# EAGLE design BeamBreak (EAGLE 6.5.0)
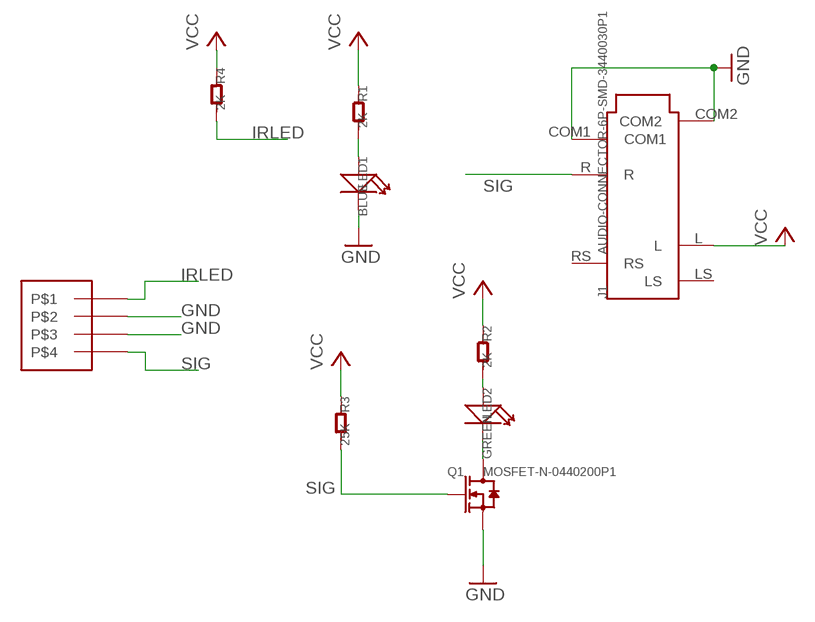
[diagram p0: schematic, sheet 1]

## Parts
J1  AUDIO-CONNECTOR-6P-SMD-3440030P1  [6P-SMD-3.5]
LED1  BLUE  LED  [LED0603]
LED2  GREEN  LED  [LED0603]
Q1  MOSFET-N-0440200P1  [SOT23]
R1  2K  R-0603  [R0603]
R2  2K  R-0603  [R0603]
R3  25K  R-0603  [R0603]
R4  2K  R-0603  [R0603]
U$1  HO4  [H04]

## Nets
GND: J1.COM1 J1.COM2 LED1.- Q1.2(S) U$1.2 U$1.3
IRLED: R4.2 U$1.1
N$1: LED2.+ R2.2
N$3: LED2.- Q1.3(D)
N$4: LED1.+ R1.2
SIG: J1.R Q1.1(G) R3.2 U$1.4
VCC: J1.L R1.1 R2.1 R3.1 R4.1
Unconnected: J1.LS J1.RS

## Library data of the parts
J1 = BeamBreak:AUDIO-CONNECTOR-6P-SMD
LED1 LED2 = BeamBreak:LED*: LED
Q1 = BeamBreak:MOSFET-N: CJ2302：SMD MOSFET N-CH 20V-2.1A
R1-R3 = BeamBreak:R*
R4 = OPL:R*
U$1 = BeamBreak:HO4: H04 1x4 pin header 0.050"

## Board
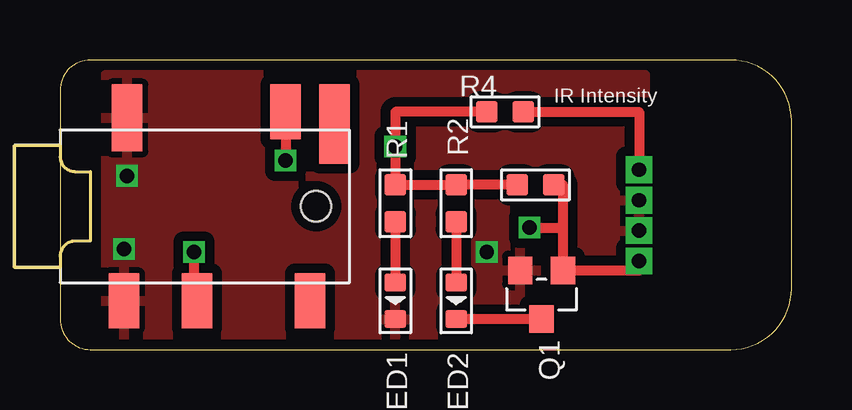
[diagram p1: board, top side]
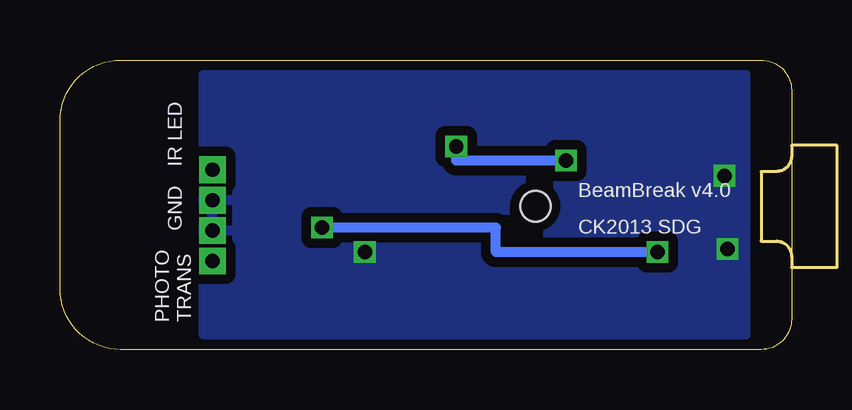
[diagram p2: board, bottom side, seen from below]

Size 30.48 x 12.06 mm. Coordinates in mm from the lower left corner, seen from the top.
Outline: 27.94,12.06 1.27,12.06 arc90 0,10.79 0,1.27 arc90 1.27,0 27.94,0 arc90 30.48,2.54 30.48,9.53 arc90 27.94,12.06
Copper layers (1*16): Top 0.035mm / dielectric 1.5mm / Bottom 0.035mm
Design rules "Seeed_DRU": minimum track width 6mil, minimum drill 12mil, track to track 6mil, track to pad 6mil, pad to pad 6mil, via to via 6mil, smd to smd 0mil, copper to edge 10mil, drill to drill 10mil, minimum pad ring 10mil, minimum via ring 6mil, stop-mask expansion 2mil, vias tented up to drill 100mil, thermal gap 10mil

### Footprints (pad centres in the part's own frame; a part is rotated, then mirrored left to right if it is on the bottom)
6P-SMD-3.5 = smd 1.27 x 2.286: COM1 2.413,3.937; L -4.318,-3.937; R -0.635,3.937; RS -5.334,3.937 | smd 1.27 x 2.794: COM2 2.286,-3.683 | smd 1.27 x 3.302: LS -6.35,-3.429 | hole 1.27: -5.588,0
LED0603 = smd 0.762 x 0.889: + -0.762,0; - 0.762,0
SOT23 = smd 1.016 x 1.143: 1 -0.889,-1.016; 2 0.889,-1.016; 3 0,1.016
R0603 = smd 0.889 x 0.889: 1 -0.762,0; 2 0.762,0
H04 = drill 0.6 pad 0.965 square: 1 0,1.905; 2 0,0.635; 3 0,-0.635; 4 0,-1.905

### Placement (x,y rotation side)
J1  5.08,5.97 180 top
LED1  13.97,2.03 270 top
LED2  16.51,2.03 270 top
Q1  20.07,2.29 180 top
R1  13.97,6.1 270 top
R2  16.51,6.1 270 top
R3  19.81,6.86 0 top
R4  18.54,9.91 0 top
U$1  24.13,5.59 0 top

### Tracks (layer width: path | path; a pad name or v marks a point on that pad's centre or on a via)
GND  (via drill 0.6)
  other vias: 2.79,7.24 2.67,4.19 17.78,4.06
  pour Bottom (isolate 0.406): 1.91,0.64 1.91,11.43 24.51,11.43 24.51,0.64
  pour Top (isolate 0.406): 1.91,11.43 1.91,0.64 24.38,0.64 24.38,11.43
IRLED
  Top 0.406: R4.2 24.13,9.91 U$1.1
N$1
  Top 0.406: R2.2 LED2.+
N$3
  Top 0.406: Q1.3 LED2.-
N$4
  Top 0.406: R1.2 LED1.+
SIG  (via drill 0.6)
  Top 0.406: R3.2 20.95,6.86 Q1.1 | J1.R 5.59,2.03 v5.59,4.06 | v19.56,5.08 20.95,5.08 Q1.1 | Q1.1 24.13,3.3 U$1.4
  Bottom 0.406: v5.59,4.06 12.32,4.06 12.32,5.08 v19.56,5.08
VCC  (via drill 0.6)
  Top 0.406: R3.1 R2.1 R1.1 v13.97,8.47 13.97,9.91 R4.1 | J1.L v9.4,7.87
  Bottom 0.406: v9.4,7.87 13.97,7.87 v13.97,8.47

### Text on the board
bPlace: IR LED | BeamBreak v4.0 | CK2013 SDG | GND | PHOTO / TRANS
tNames: IR Intensity